# Altium schematic sheet B.SchDoc
size A
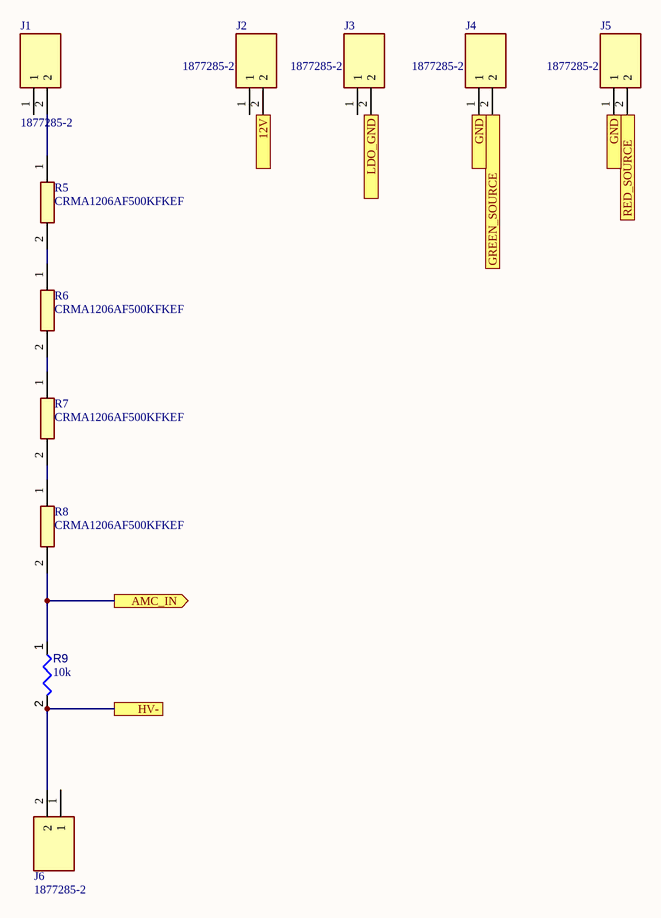
[diagram p0: B.SchDoc]

## Parts
J1  1877285-2  [18772852]
J2  1877285-2  [18772852]
J3  1877285-2  [18772852]
J4  1877285-2  [18772852]
J5  1877285-2  [18772852]
J6  1877285-2  [18772852]
R5  CRMA1206AF500KFKEF  [RESC3216X74N]
R6  CRMA1206AF500KFKEF  [RESC3216X74N]
R7  CRMA1206AF500KFKEF  [RESC3216X74N]
R8  CRMA1206AF500KFKEF  [RESC3216X74N]
R9  value 10k  [RESC2013X50X35ML15T15]  (hidden comment: Resistor 10k +/-1% 0805 125 mW)

## Ports
12V (out), AMC_IN (out), GND, GREEN_SOURCE (in), HV-, LDO_GND, RED_SOURCE

## Nets
12V: J2.2 ; port 12V
AMC_IN: R8.2 R9.1 ; port AMC_IN
GND: J4.1 J5.1 ; port GND
GREEN_SOURCE: J4.2 ; port GREEN_SOURCE
HV-: J6.2 R9.2 ; port HV-
LDO_GND: J3.2 ; port LDO_GND
RED_SOURCE: J5.2 ; port RED_SOURCE
NetJ1_2: J1.2 R5.1
NetR5_2: R5.2 R6.1
NetR6_2: R6.2 R7.1
NetR7_2: R7.2 R8.1

Not connected (* = marked no-connect by the designer): J1 1; J2 1; J3 1; J6 1

## Library data of the parts
J1-J6 = 1877285-2: Connector; Manufacturer_Name: TE Connectivity; Datasheet Link: https://www.te.com/commerce/DocumentDelivery/DDEController?Action=srchrtrv&DocNm=7-1773458-5_ECONOMY_POWER_QRG&DocType=Data%20Sheet&DocLang=English&PartCntxt=1877285-2&DocFormat=pdf; Height: 12mm; Manufacturer_Part_Number: 1877285-2; Mouser Part Number: 571-1877285-2; Mouser Price/Stock: https://www.mouser.co.uk/ProductDetail/TE-Connectivity/1877285-2?qs=ka3zfMQDmFlAIZq5pDt5JA%3D%3D; Arrow Part Number: 1877285-2; Arrow Price/Stock: https://www.arrow.com/en/products/1877285-2/te-connectivity?region=europe
R5-R8 = CRMA1206AF500KFKEF: Resistor; Manufacturer_Name: Vishay; Datasheet Link: https://www.vishay.com/docs/68043/crma.pdf; Height: 0.74mm; Manufacturer_Part_Number: CRMA1206AF500KFKEF; Mouser Part Number: 71-CRMA1206AF500KFKF; Mouser Price/Stock: https://www.mouser.co.uk/ProductDetail/Vishay-Techno/CRMA1206AF500KFKEF?qs=1mbolxNpo8cDdncTsqghaQ%3D%3D; Arrow Part Number: CRMA1206AF500KFKEF; Arrow Price/Stock: https://www.arrow.com/en/products/crma1206af500kfkef/vishay?region=nac
R9 = CMP-009-00018-5: Chip Resistor, 10 KOhm, +/- 1%, 125 mW, -55 to 155 degC, 0805 (2012 Metric); Power: 125mW; Voltage Rating: 150V; Tolerance: 1%; Pins: 2; Min Operating Temperature: -55°C; Case/Package: 0805; Max Operating Temperature: 155°C; RoHS Compliant: True; Mounting Technology: SM